# Altium project EL.T01.PWRM.PrjPcb (part 2 of 2)

## Sheet Reference_2V5.SchDoc
size A4; SheetNumber: 7; SheetTotal: 8
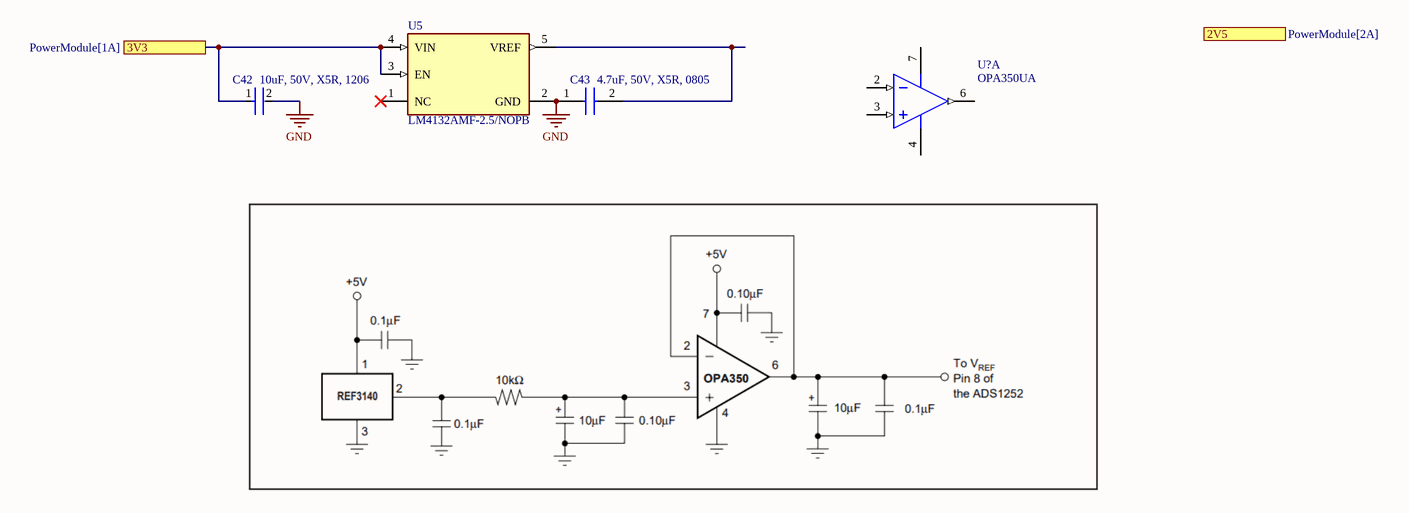
[diagram p8: Reference_2V5.SchDoc]

### Parts
C42  10uF, 50V, X5R, 1206  [FP-CL32-IPC_B]
C43  4.7uF, 50V, X5R, 0805  [CAPC2012X145N]
U5  LM4132AMF-2.5/NOPB  [FP-DBV0005A-IPC_C]
U?  OPA350UA  [D0008A_M]  (part A of 2)

### Ports
2V5 (see PowerModule[2A]), 3V3 (see PowerModule[1A])

### Nets
3V3_F: C42.1 U5.3(EN) U5.4(VIN) ; port 3V3
GND: C42.2 C43.1 U5.2(GND)  [project net GND_2]
NetC43_2: C43.2 U5.5(VREF)

Not connected (* = marked no-connect by the designer): U5 1(NC)*; U? 2(IN-) 3(IN+) 4(V-) 6(OUT) 7(V+)

### Library data of the parts
C42 = CMP-13271-003570-1: Cap Ceramic 10uF 50V X7R ±10% SMD 1210 +125°C Embossed T/R; Case Code (Imperial): 1210; Case Code (Metric): 3225; Packaging: Cut Tape; Tolerance: 10%; Max Operating Temperature: 125°C; Mount: Surface Mount; Min Operating Temperature: -55°C; Features: Soft Termination; Capacitance: 10uF; Case/Package: 1210; Voltage Rating: 50V
C43 = GRM21BR61H475ME51L: Capacitor; Manufacturer_Name: Murata Electronics; Datasheet Link: https://search.murata.co.jp/Ceramy/image/img/A01X/G101/ENG/GRM21BR61H475ME51-01A.pdf; Height: 1.45mm; Manufacturer_Part_Number: GRM21BR61H475ME51L; Mouser Part Number: 81-GRM21BR61H475M51L; Mouser Price/Stock: https://www.mouser.co.uk/ProductDetail/Murata-Electronics/GRM21BR61H475ME51L?qs=eeBpzGFlv%252B%2Fg0wAeHy0eJw%3D%3D; Arrow Part Number: GRM21BR61H475ME51L; Arrow Price/Stock: https://www.arrow.com/en/products/grm21br61h475me51l/murata-manufacturing?region=nac
U5 = CMP-0074-00531-5: IC VREF SERIES 0.05% SOT23-5; Quiescent Current: 100uA; Output Current: 20mA; Number of Channels: 1; Temperature Coefficient: 20ppm/°C; Max Input Voltage: 6V; Output Voltage: 2.5V; Max Supply Voltage: 2.2V; Dropout Voltage: 175mV; Supply Current: 60uA; Output Type: Fixed; Length: 2.92mm; Radiation Hardening: No; Reference Type: Series; Mount: Surface Mount; Packaging: Tape and Reel; Width: 1.6mm; Max Operating Temperature: 125°C; Lead Free: Lead Free; Series: -; Number of Pins: 5; REACH SVHC: No SVHC; Max Output Voltage: 2.5V; Package Quantity: 1000; Tolerance: 0.05%; Min Input Voltage: 2.2V; Case/Package: SOT-23; Termination: SMD/SMT; Height: 1.02mm; Min Output Voltage: 2.5V; Reference Voltage: 2.5V; Max Output Current: 20mA; Nominal Supply Current: 60uA; Min Operating Temperature: -40°C; Operating Supply Current: 100uA
U? = CMP-0271-00145-3: High-Speed, Single-Supply, Rail-to-Rail Operational Amplifier MicroAmplifier(TM) Series, 2.7 to 5.5 V, -40 to 85 degC, 8-pin SOIC (D8), Green (RoHS & no Sb/Br); Manufacturer: Texas Instruments; IIB(Max)(pA): 10; Iq per channel(Max)(mA): 8.5; Number of Channels: 1; CMRR(Min)(dB): 66; Slew Rate(Typ)(V/us): 22; Total Supply Voltage(Max)(+5V is 5, +/-5V is 10): 5.5; Sub Family: Low Input Bias Current Amp (<=10pA), Low Offset Voltage Amplifier (<=500uV), Low Supply Voltage Amplifier (<=2.7V), Precision Amplifier; Offset Drift(Typ)(uV/C): 4; Total Supply Voltage(Min)(+5V is 5, +/-5V is 10): 2.7; Vn at 1kHz(Typ)(nV/rtHz): 18; PackageReference: D0008A; PackageDescription: 8-Pin Plastic Small Outline, Body 4.9 x 3.9 mm, Pitch 1.27 mm; Code_JEDEC: MS-012; Eco-Plan: Green (RoHS & no Sb/Br); DatasheetVersion: SBOS099C; Vio (25C)(Max)(mV): 1; ComponentLink1URL: http://www.ti.com/; ComponentLink3URL: http://www.ti.com/litv/pdf/msoi002j; PackageVersion: 4040047-3/M, 06/2011; ComponentLink3Description: Package Specification; ComponentLink2URL: http://www.ti.com/general/docs/lit/getliterature.tsp?genericPartNumber=OPA350&fileType=pdf; PartNumber: OPA350UA; ComponentLink2Description: Datasheet; ComponentLink1Description: Manufacturer URL; Mounting Technology: Surface Mount

## Sheet FanControl.SchDoc
size A4; SheetNumber: 8; SheetTotal: 9
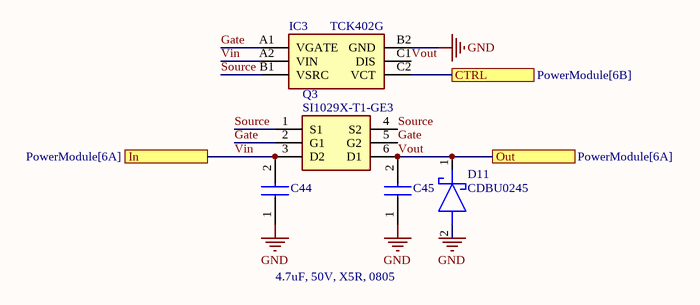
[diagram p9: FanControl.SchDoc]

### Parts
C44  4.7uF, 50V, X5R, 0805  [CAPC2012X145N]  (value not drawn)
C45  4.7uF, 50V, X5R, 0805  [CAPC2012X145N]  (value not drawn)
D11  CDBU0245  [DIOC1709X85N]
IC3  TCK402G  [BGA6C40P2X3_80X120X59]
Q3  SI1029X-T1-GE3  [SOTFL50P160X60-6N]

### Ports
CTRL (see PowerModule[6B]), In (see PowerModule[6A]), Out (see PowerModule[6A])

### Nets
GND: C44.1 C45.1 D11.2(A) IC3.B2(GND)  [project net GND_2]
Vin: C44.2 IC3.A2(VIN) Q3.3(D2) ; port In
cFan-PWM: IC3.C2(VCT) ; port CTRL
Gate: IC3.A1(VGATE) Q3.2(G1) Q3.5(G2)
Source: IC3.B1(VSRC) Q3.1(S1) Q3.4(S2)
Vout: C45.2 D11.1(K) IC3.C1(DIS) Q3.6(D1) ; port Out

### Notes on the sheet
- 4.7uF, 50V, X5R, 0805

### Library data of the parts
C44 C45 = GRM21BR61H475ME51L: as C43 on sheet Reference_2V5; Datasheet Link: https://search.murata.co.jp/Ceramy/image/img/A01X/G101/ENG/GRM21BR61H475ME51-01A.pdf; Height: 1.45mm; Manufacturer_Part_Number: GRM21BR61H475ME51L; Mouser Part Number: 81-GRM21BR61H475M51L; Mouser Price/Stock: https://www.mouser.co.uk/ProductDetail/Murata-Electronics/GRM21BR61H475ME51L?qs=eeBpzGFlv%252B%2Fg0wAeHy0eJw%3D%3D; Arrow Part Number: GRM21BR61H475ME51L; Arrow Price/Stock: https://www.arrow.com/en/products/grm21br61h475me51l/murata-manufacturing?region=nac
D11 = CDBU0245: Schottky Diode; Manufacturer_Name: Comchip Technology; Datasheet Link: https://componentsearchengine.com/Datasheets/1/CDBU0245.pdf; Height: 0.85mm; Manufacturer_Part_Number: CDBU0245; Mouser Part Number: 750-CDBU0245; Mouser Price/Stock: https://www.mouser.co.uk/ProductDetail/Comchip-Technology/CDBU0245?qs=tw%252BuQ%2FB6PO2XscGM2Q%2FbYQ%3D%3D; Arrow Part Number: CDBU0245; Arrow Price/Stock: https://www.arrow.com/en/products/cdbu0245/comchip-technology?utm_currency=USD&region=nac
IC3 = TCK402G: Integrated Circuit; Manufacturer_Name: Toshiba; Datasheet Link: https://toshiba.semicon-storage.com/info/docget.jsp?did=59174&prodName=TCK402G; Height: 0.59mm; Manufacturer_Part_Number: TCK402G
Q3 = SI1029X-T1-GE3: Transistor; Manufacturer_Name: Vishay; Datasheet Link: https://www.vishay.com/docs/71435/71435.pdf; Height: 0.6mm; Manufacturer_Part_Number: SI1029X-T1-GE3; Mouser Part Number: 781-SI1029X-T1-GE3; Mouser Price/Stock: https://www.mouser.co.uk/ProductDetail/Vishay-Semiconductors/SI1029X-T1-GE3?qs=tWM4QuTcS4WFBF4Fada7Qg%3D%3D

## Nets that join several sheets
3V3_F: PowerModule (C2.2 C3.2 IC1.21 J27.1), Reference_2V5 (C42.1 U5.3 U5.4)
20V_F: PowerModule (J25.1), PowerModuleCell_M1 (C4_PowerModuleCell_M1.2 U1_PowerModuleCell_M1.11), PowerModuleCell_M2 (C4_PowerModuleCell_M2.2 U1_PowerModuleCell_M2.11), PowerModuleCell_M3 (C4_PowerModuleCell_M3.2 U1_PowerModuleCell_M3.11), PowerModuleCell_M4 (C4_PowerModuleCell_M4.2 U1_PowerModuleCell_M4.11)
GND_1: PowerModule (6 pins), ISO_12V_to_20V (C17.1 PS1.2), Opto (Q2_Opto2.3), Opto (Q2_Opto1.2), ISO_Signals (7 pins)
GND_2: PowerModule (49 pins), PowerModuleCell_M1 (8 pins), PowerModuleCell_M2 (8 pins), PowerModuleCell_M3 (8 pins), PowerModuleCell_M4 (8 pins), ISO_12V_to_20V (C18.2 C19.1 PS1.6), LDO_3V3 (5 pins), Opto (Q2_Opto2.2), Opto (Q2_Opto1.3), ISO_Signals (IC2#2.9), Reference_2V5 (C42.2 C43.1 U5.2), FanControl (C44.1 C45.1 D11.2 IC3.B2)
ISO_12V: PowerModule (J23.1 P1.1 P2.1 R7.2), ISO_12V_to_20V (C17.2 L1.1)
Vcc_1: PowerModule (J3.3 J7.3 P1.9 P2.9), Opto (R33_Opto2.1), ISO_Signals (8 pins)
Vcc_2: PowerModule (21 pins), LDO_3V3 (C22.2 C23.2 IC2#1.2), Opto (R33_Opto1.1)
Vin: PowerModule (J24.1 R1.2 R6.2), ISO_12V_to_20V (C18.1 C19.2 PS1.7), LDO_3V3 (C20.2 C21.2 IC2#1.3), FanControl (C44.2 IC3.A2 Q3.3)
ALERT-MISO: PowerModule (D4.1 IC1.29), Opto (R34_Opto2.1)
ALERT-MOSI: PowerModule (D3.1 IC1.25), Opto (Q2_Opto1.4 R33_Opto1.2)
cFan-PWM: PowerModule (IC1.15), FanControl (IC3.C2)
I2C1_SCL: PowerModule (IC1.46 J4.2 R9.1 R13.1), ISO_Signals (IC2#2.13)
I2C1_SDA: PowerModule (IC1.47 J4.4 R8.1 R12.1), ISO_Signals (IC2#2.11)
ISO_ALERT-MISO: PowerModule (P1.4 P2.4), Opto (Q2_Opto2.4 R33_Opto2.2)
ISO_ALERT-MOSI: PowerModule (P1.6 P2.6), Opto (R34_Opto1.1)
ISO_I2C_SCL: PowerModule (J3.2 P1.3 P2.3), ISO_Signals (IC2#2.4)
ISO_I2C_SDA: PowerModule (J3.4 P1.5 P2.5), ISO_Signals (IC2#2.6)
ISO_USART_RX: PowerModule (J7.2 P1.8 P2.8), ISO_Signals (IC2#2.5)
ISO_USART_TX: PowerModule (J7.4 P1.10 P2.10), ISO_Signals (IC2#2.3)
Load: PowerModule (16 pins), PowerModuleCell_M1 (6 pins), PowerModuleCell_M2 (6 pins), PowerModuleCell_M3 (6 pins), PowerModuleCell_M4 (6 pins)
ProcessedParam_M1: PowerModule (IC1.42), PowerModuleCell_M1 (J34_PowerModuleCell_M1.1 R?_PowerModuleCell_M1#1.2)
ProcessedParam_M2: PowerModule (IC1.31), PowerModuleCell_M3 (J34_PowerModuleCell_M3.1 R?_PowerModuleCell_M3#1.2)
ProcessedParam_M3: PowerModule (IC1.24), PowerModuleCell_M2 (J34_PowerModuleCell_M2.1 R?_PowerModuleCell_M2#1.2)
ProcessedParam_M4: PowerModule (IC1.22), PowerModuleCell_M4 (J34_PowerModuleCell_M4.1 R?_PowerModuleCell_M4#1.2)
USART2_RX: PowerModule (IC1.38 J13.2 R11.1), ISO_Signals (IC2#2.14)
USART2_TX: PowerModule (IC1.41 J13.4 R10.1), ISO_Signals (IC2#2.12)
Vout: PowerModule (J1.1), FanControl (C45.2 D11.1 IC3.C1 Q3.6)